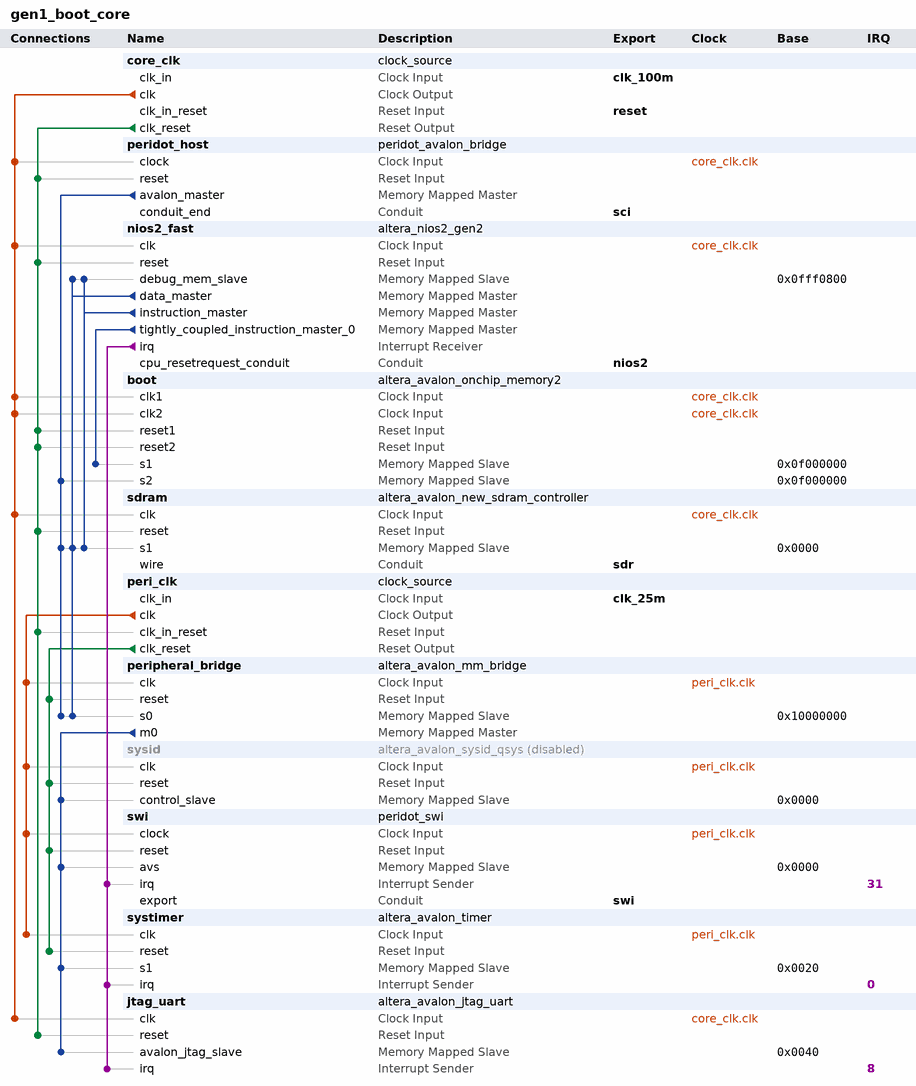
[diagram p0: system contents]
# Platform Designer (Qsys) system gen1_boot_core, Cyclone IV E EP4CE6E22C8
# Parameters at their usual value, and those the tool derives, are not listed.
package require -exact qsys 16.1
create_system gen1_boot_core
set_project_property DEVICE_FAMILY {Cyclone IV E}
set_project_property DEVICE EP4CE6E22C8

add_instance core_clk clock_source 16.1
set_instance_parameter_value core_clk clockFrequency 100000000

add_instance peridot_host peridot_avalon_bridge 0.9

add_instance nios2_fast altera_nios2_gen2 16.1
set_instance_parameter_value nios2_fast cpuReset true
set_instance_parameter_value nios2_fast dcache_size 0
set_instance_parameter_value nios2_fast exceptionSlave sdram.s1
set_instance_parameter_value nios2_fast icache_numTCIM 1
set_instance_parameter_value nios2_fast icache_size 16384
set_instance_parameter_value nios2_fast impl Fast
set_instance_parameter_value nios2_fast mul_64_impl 1
set_instance_parameter_value nios2_fast resetSlave boot.s1
set_instance_parameter_value nios2_fast setting_branchpredictiontype Static
set_instance_parameter_value nios2_fast shift_rot_impl 0

add_instance boot altera_avalon_onchip_memory2 16.1
set_instance_parameter_value boot dataWidth 32
set_instance_parameter_value boot dualPort true
set_instance_parameter_value boot initMemContent true
set_instance_parameter_value boot initializationFileName onchip_mem.hex
set_instance_parameter_value boot memorySize 2048

add_instance sdram altera_avalon_new_sdram_controller 16.1
set_instance_parameter_value sdram TAC 5.4
set_instance_parameter_value sdram TRCD 21.0
set_instance_parameter_value sdram TRFC 63.0
set_instance_parameter_value sdram TRP 21.0
set_instance_parameter_value sdram casLatency 3
set_instance_parameter_value sdram columnWidth 8
set_instance_parameter_value sdram dataWidth 16
set_instance_parameter_value sdram generateSimulationModel false
set_instance_parameter_value sdram model single_Micron_MT48LC4M32B2_7_chip
set_instance_parameter_value sdram numberOfBanks 4
set_instance_parameter_value sdram numberOfChipSelects 1
set_instance_parameter_value sdram powerUpDelay 200.0
set_instance_parameter_value sdram refreshPeriod 15.625
set_instance_parameter_value sdram rowWidth 12

add_instance peri_clk clock_source 16.1
set_instance_parameter_value peri_clk clockFrequency 25000000

add_instance peripheral_bridge altera_avalon_mm_bridge 16.1
set_instance_parameter_value peripheral_bridge ADDRESS_UNITS SYMBOLS
set_instance_parameter_value peripheral_bridge ADDRESS_WIDTH 10
set_instance_parameter_value peripheral_bridge DATA_WIDTH 32
set_instance_parameter_value peripheral_bridge MAX_PENDING_RESPONSES 1
set_instance_parameter_value peripheral_bridge USE_AUTO_ADDRESS_WIDTH 1

add_instance sysid altera_avalon_sysid_qsys 16.1
set_instance_property sysid ENABLED false
set_instance_parameter_value sysid id 1923088385

add_instance swi peridot_swi 1.1
set_instance_parameter_value swi CLASSID 1923088385
set_instance_parameter_value swi CLOCKFREQ 25000000
set_instance_parameter_value swi PART_NAME EP4CE6E22C8
set_instance_parameter_value swi TIMECODE 0

add_instance systimer altera_avalon_timer 16.1
set_instance_parameter_value systimer period 1
set_instance_parameter_value systimer periodUnits MSEC

add_instance jtag_uart altera_avalon_jtag_uart 16.1
set_instance_parameter_value jtag_uart simInteractiveOptions NO_INTERACTIVE_WINDOWS

# connections
add_connection core_clk.clk boot.clk1 clock
add_connection core_clk.clk boot.clk2 clock
add_connection core_clk.clk jtag_uart.clk clock
add_connection core_clk.clk nios2_fast.clk clock
add_connection core_clk.clk peridot_host.clock clock
add_connection core_clk.clk sdram.clk clock
add_connection peri_clk.clk peripheral_bridge.clk clock
add_connection peri_clk.clk swi.clock clock
add_connection peri_clk.clk sysid.clk clock
add_connection peri_clk.clk systimer.clk clock
add_connection core_clk.clk_reset boot.reset1 reset
add_connection core_clk.clk_reset boot.reset2 reset
add_connection core_clk.clk_reset jtag_uart.reset reset
add_connection core_clk.clk_reset nios2_fast.reset reset
add_connection core_clk.clk_reset peri_clk.clk_in_reset reset
add_connection core_clk.clk_reset peridot_host.reset reset
add_connection core_clk.clk_reset sdram.reset reset
add_connection peri_clk.clk_reset peripheral_bridge.reset reset
add_connection peri_clk.clk_reset swi.reset reset
add_connection peri_clk.clk_reset sysid.reset reset
add_connection peri_clk.clk_reset systimer.reset reset
add_connection nios2_fast.data_master nios2_fast.debug_mem_slave avalon
set_connection_parameter_value nios2_fast.data_master/nios2_fast.debug_mem_slave baseAddress 0x0fff0800
add_connection nios2_fast.data_master peripheral_bridge.s0 avalon
set_connection_parameter_value nios2_fast.data_master/peripheral_bridge.s0 baseAddress 0x10000000
add_connection nios2_fast.data_master sdram.s1 avalon
set_connection_parameter_value nios2_fast.data_master/sdram.s1 baseAddress 0x0000
add_connection nios2_fast.instruction_master nios2_fast.debug_mem_slave avalon
set_connection_parameter_value nios2_fast.instruction_master/nios2_fast.debug_mem_slave baseAddress 0x0fff0800
add_connection nios2_fast.instruction_master sdram.s1 avalon
set_connection_parameter_value nios2_fast.instruction_master/sdram.s1 baseAddress 0x0000
add_connection nios2_fast.tightly_coupled_instruction_master_0 boot.s1 avalon
set_connection_parameter_value nios2_fast.tightly_coupled_instruction_master_0/boot.s1 baseAddress 0x0f000000
add_connection peridot_host.avalon_master boot.s2 avalon
set_connection_parameter_value peridot_host.avalon_master/boot.s2 baseAddress 0x0f000000
add_connection peridot_host.avalon_master peripheral_bridge.s0 avalon
set_connection_parameter_value peridot_host.avalon_master/peripheral_bridge.s0 baseAddress 0x10000000
add_connection peridot_host.avalon_master sdram.s1 avalon
set_connection_parameter_value peridot_host.avalon_master/sdram.s1 baseAddress 0x0000
add_connection peripheral_bridge.m0 jtag_uart.avalon_jtag_slave avalon
set_connection_parameter_value peripheral_bridge.m0/jtag_uart.avalon_jtag_slave baseAddress 0x0040
add_connection peripheral_bridge.m0 swi.avs avalon
set_connection_parameter_value peripheral_bridge.m0/swi.avs baseAddress 0x0000
add_connection peripheral_bridge.m0 sysid.control_slave avalon
set_connection_parameter_value peripheral_bridge.m0/sysid.control_slave baseAddress 0x0000
add_connection peripheral_bridge.m0 systimer.s1 avalon
set_connection_parameter_value peripheral_bridge.m0/systimer.s1 baseAddress 0x0020
add_connection nios2_fast.irq jtag_uart.irq interrupt
set_connection_parameter_value nios2_fast.irq/jtag_uart.irq irqNumber 8
add_connection nios2_fast.irq swi.irq interrupt
set_connection_parameter_value nios2_fast.irq/swi.irq irqNumber 31
add_connection nios2_fast.irq systimer.irq interrupt
set_connection_parameter_value nios2_fast.irq/systimer.irq irqNumber 0

# exported interfaces
add_interface clk_100m clock sink
set_interface_property clk_100m EXPORT_OF core_clk.clk_in
add_interface clk_25m clock sink
set_interface_property clk_25m EXPORT_OF peri_clk.clk_in
add_interface nios2 conduit end
set_interface_property nios2 EXPORT_OF nios2_fast.cpu_resetrequest_conduit
add_interface reset reset sink
set_interface_property reset EXPORT_OF core_clk.clk_in_reset
add_interface sci conduit end
set_interface_property sci EXPORT_OF peridot_host.conduit_end
add_interface sdr conduit end
set_interface_property sdr EXPORT_OF sdram.wire
add_interface swi conduit end
set_interface_property swi EXPORT_OF swi.export

set_interconnect_requirement {$system} qsys_mm.clockCrossingAdapter HANDSHAKE
set_interconnect_requirement {$system} qsys_mm.enableEccProtection FALSE
set_interconnect_requirement {$system} qsys_mm.insertDefaultSlave FALSE
set_interconnect_requirement {$system} qsys_mm.maxAdditionalLatency 1

save_system gen1_boot_core.qsys
